# EAGLE design LDConnector v3 (EAGLE 7.7.0)
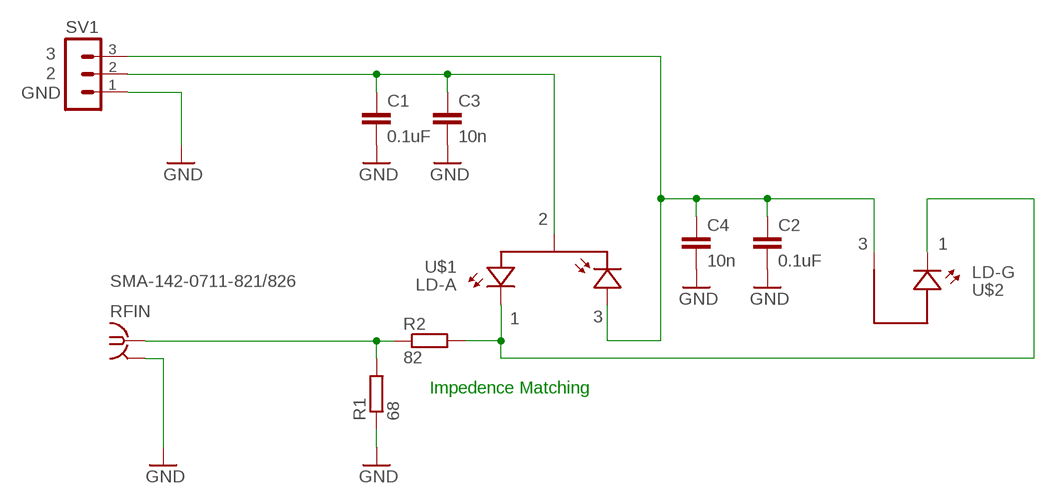
[diagram p0: schematic, sheet 1]

## Parts
C1  0.1uF  C-EUC0603  [C0603]
C2  0.1uF  C-EUC0603  [C0603]
C3  10n  C-EUC0603  [C0603]
C4  10n  C-EUC0603  [C0603]
R1  68  R-EU_R0603  [R0603]
R2  82  R-EU_R0603  [R0603]
RFIN  SMA-142-0711-821/826  [J502-ND-142-0711-821/826]
SV1  MA03-1  [MA03-1]
U$1  LD-A  [TYPEA]
U$2  LD-G  [TYPEG]

## Nets
GND: C1.2 C2.2 C3.2 C4.2 R1.1 RFIN.G@1 RFIN.G@2 RFIN.G@3 RFIN.G@4 SV1.1
N$1: C1.1 C3.1 SV1.2 U$1.2-PDC-LDA(LDA-PDC)
N$2: R2.2 U$1.1-LDC(LDC) U$2.1-LDC(LDC)
N$3: R1.2 R2.1 RFIN.1
N$6: C2.1 C4.1 SV1.3 U$1.3-PDA(PDA) U$2.3-LDA(LDA)

## Notes on the sheet
- 3
- 2
- GND
- 2
- 3 | 1
- 1 | 3
- Impedence Matching

## Library data of the parts
C1-C4 = rcl:C-EU: CAPACITOR, European symbol
R1 R2 = rcl:R-EU_: RESISTOR, European symbol
RFIN = con-coax:SMA-: SMA 50 Ohm End Launch Jack Receptacle - Round Contact Johnson Components Source: www.johnsoncomponents.com .. J502-ND.pdf; MF: JOHNSON COMPONENTS; MPN: 142-0711-821; OC_FARNELL: 1019328; OC_NEWARK: 16F3627
SV1 = con-lstb:MA03-1: PIN HEADER; OC_FARNELL: unknown; OC_NEWARK: unknown
U$1 = laser diode:LD-A
U$2 = laser diode:LD-G

## Board
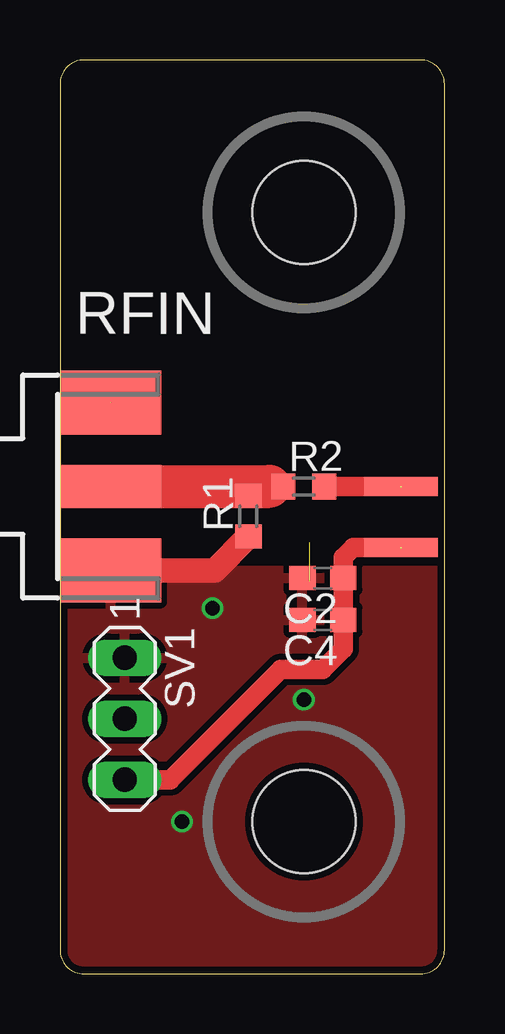
[diagram p1: board, top side]
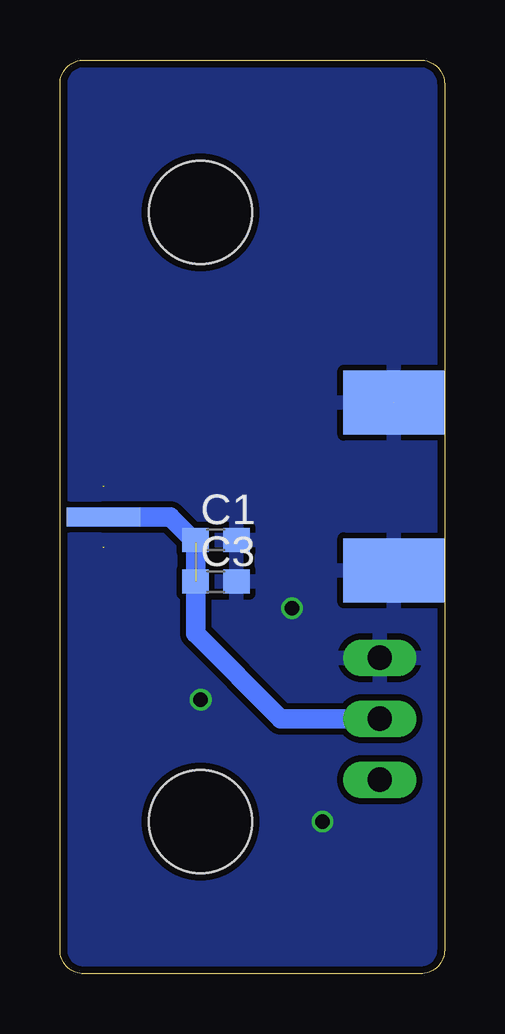
[diagram p2: board, bottom side, seen from below]

Size 16.02 x 38.1 mm. Coordinates in mm from the lower left corner, seen from the top.
Outline: 0,37.1 0,1 arc90 1,0 15.02,0 arc90 16.02,1 16.02,37.1 arc90 15.02,38.1 1,38.1 arc90 0,37.1
Copper layers (1*16): Top 0.035mm / dielectric 1.6mm / Bottom 0.035mm
Design rules "Elecrow_2-layer_PCB_eagle_rule *": minimum track width 6mil, minimum drill 12mil, track to track 10mil, track to pad 10mil, pad to pad 10mil, via to via 10mil, smd to smd 0mil, copper to edge 0.3mm, drill to drill 10mil, minimum pad ring 6mil, minimum via ring 6mil, stop-mask expansion 0mil, vias tented up to drill 100mil, thermal gap 10mil
Holes 4.3 mm at 10.16,31.75 10.16,6.35

### Footprints (pad centres in the part's own frame; a part is rotated, then mirrored left to right if it is on the bottom)
C0603 = smd 1.1 x 1: 1 -0.85,0; 2 0.85,0
R0603 = smd 1 x 1.1: 1 -0.85,0; 2 0.85,0
J502-ND-142-0711-821/826 = smd 4.191 x 1.778: 1 2.115,0 | smd 4.191 x 2.667: G@1 2.115,3.495; G@2 2.115,-3.495 | smd 4.191 x 2.667 bottom: G@3 2.115,3.495; G@4 2.115,-3.495
MA03-1 = drill 1.016 long: 1 -2.54,0; 2 0,0; 3 2.54,0
TYPEA = smd 3 x 0.8: 1-LDC -1.8,-1.27; 3-PDA -1.8,1.27 | smd 3 x 0.8 bottom: 2-PDC-LDA -1.8,0
TYPEG = smd 3 x 0.8: 1-LDC -1.8,1.27; 3-LDA -1.8,-1.27 | smd 3 x 0.8 bottom: 2-NC -1.8,0

### Placement (x,y rotation side)
C1  9.53,18.1 0 bottom
C2  10.95,16.51 180 top
C3  9.53,16.35 0 bottom
C4  10.95,14.76 180 top
R1  7.85,19.08 90 top
R2  10.16,20.32 0 top
RFIN  0,20.32 0 top
SV1  2.7,10.64 270 top
U$1  12.38,19.05 180 top
U$2  16.03,19.05 0 top

### Tracks (layer width: path | path; a pad name or v marks a point on that pad's centre or on a via)
GND  (via drill 0.6)  (1 unrouted)
  Top 1.016: R1.1 6.45,16.82 RFIN.G@4
  other vias: 6.35,15.24 10.16,11.43 5.08,6.35
  pour Bottom: -1.27,38.1 17.78,38.1 17.78,0 0,0
  pour Top: 0.16,16.83 16.03,16.83 16.03,14.13 15.88,14.13 15.88,0 0.16,0
N$1  (1 unrouted)
  Bottom 0.61: C1.1 10.38,18
  Bottom 0.813: C1.1 10.38,14.19 6.83,10.64 SV1.2 | 10.38,18 11.43,19.05 U$1.2-PDC-LDA
N$2  (1 unrouted)
  Top 0.813: U$1.1-LDC R2.2
N$3
  Top 1.016: RFIN.1 R2.1 8.24,20.32 R1.2
N$4
  Top 1.8: 3.33,20.32 8.73,20.32
N$6  (1 unrouted)
  Top 0.813: SV1.3 4.6,8.1 9.21,12.7 10.95,12.7 11.8,13.55 C4.1 C2.1 11.8,17.36 12.22,17.78 U$1.3-PDA

### Text on the board
tStop: Mitch / Cox / 2017
tDocu: Type G: / 1 LDC / 2 NC / 3 LDA | Type A: / 1 LDC / 2 COM / 3 PDA | 1 | *G | 3 | GND | 2 | 3
bDocu: M4 | 2 | *A